# Altium schematic sheet Description_Errata.SchDoc: Description and Errata
size 279 x 215 mm; CompanyName: Flat Earth Inc.; DrawnBy: Connor Dack; Engineer: Connor Dack; Address1: 985 Technology Blvd; Address2: Suite 102; Address3: Bozeman, MT, 59718; DocumentNumber: 1; Revision: 0.0; SheetNumber: 1; SheetTotal: 8
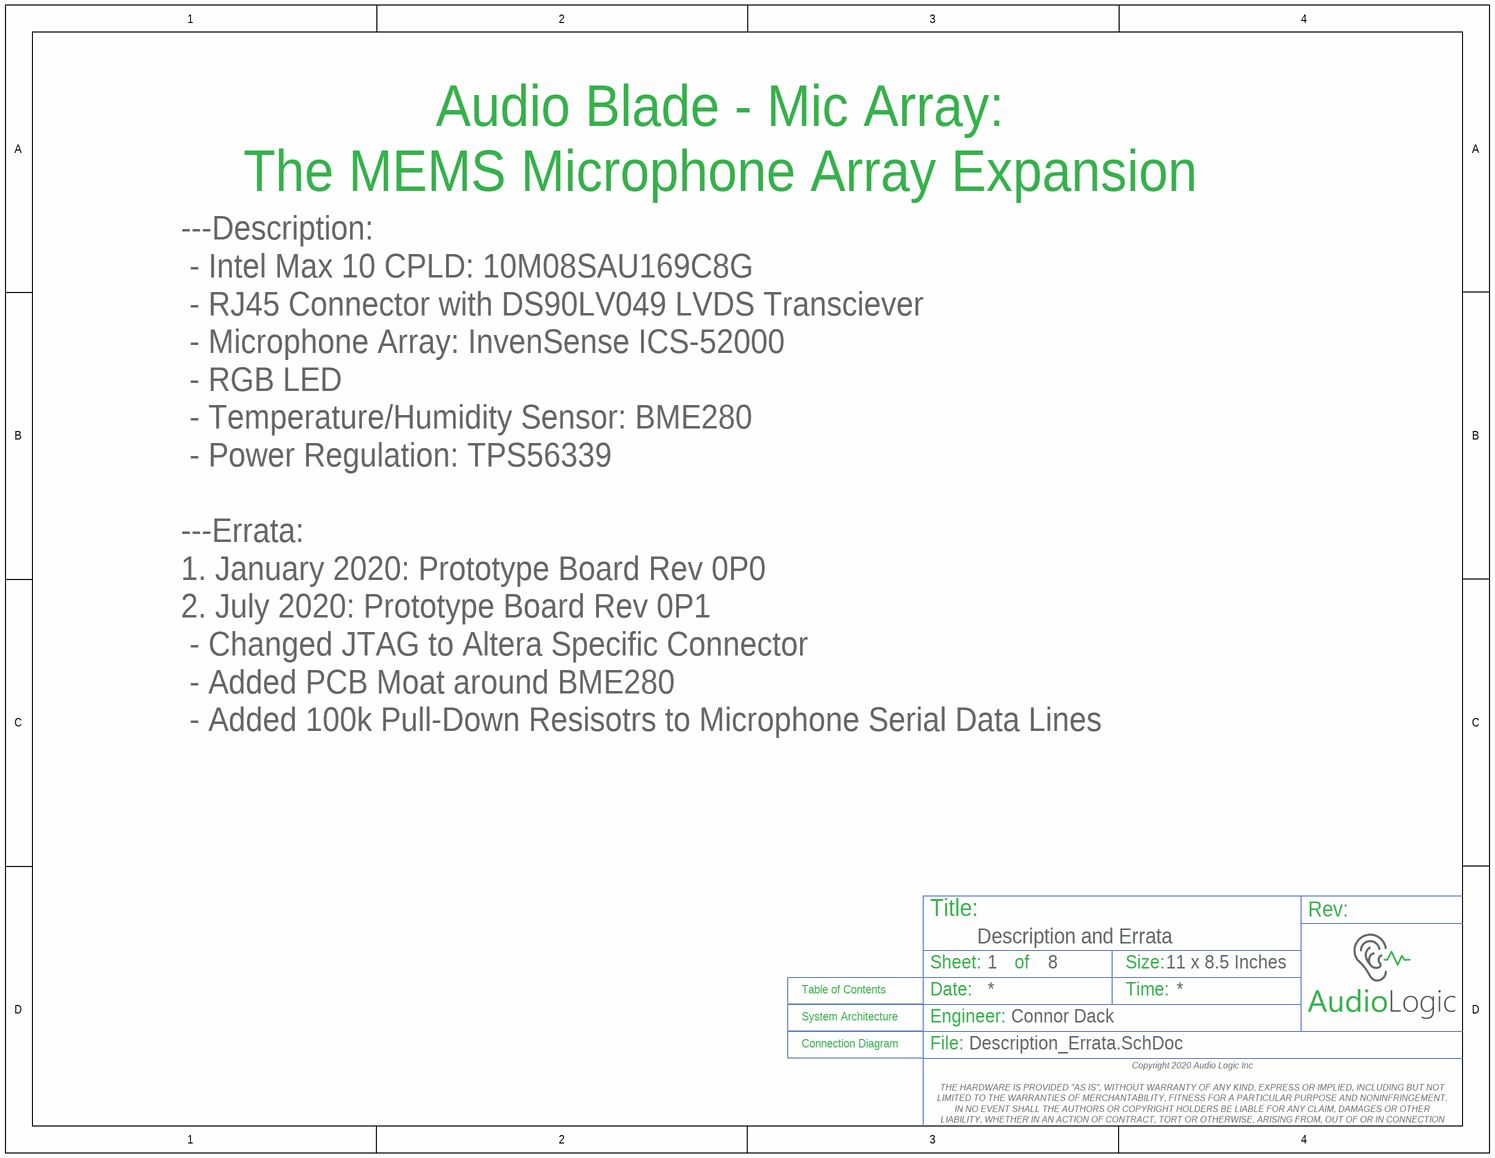
[diagram p0: Description_Errata.SchDoc]

## Sub-sheets
Connection Diagram = Top_Level_BD.SchDoc: no entries
System Architecture = System_Architecture.SchDoc: no entries
Table of Contents = Table_Of_Contents.SchDoc: no entries

## Notes on the sheet
- Audio Blade - Mic Array:
  The MEMS Microphone Array Expansion Board
- ---Description:
  - Intel Max 10 CPLD: 10M08SAU169C8G
  - RJ45 Connector with DS90LV049 LVDS Transciever
  - Microphone Array: InvenSense ICS-52000
  - RGB LED
  - Temperature/Humidity Sensor: BME280
  - Power Regulation: TPS56339
  ---Errata:
  1. January 2020: Prototype Board Rev 0P0
  2. July 2020: Prototype Board Rev 0P1
  - Changed JTAG to Altera Specific Connector
  - Added PCB Moat around BME280
  - Added 100k Pull-Down Resisotrs to Microphone Serial Data Lines
- Title:
- Sheet:
- of
- Size:
- 11 x 8.5 Inches
- Rev:
- Date:
- Engineer:
- Time:
- File:
- Copyright 2020 Audio Logic Inc
  THE HARDWARE IS PROVIDED "AS IS", WITHOUT WARRANTY OF ANY KIND, EXPRESS OR IMPLIED, INCLUDING BUT NOT LIMITED TO THE WARRANTIES OF MERCHANTABILITY, FITNESS FOR A PARTICULAR PURPOSE AND NONINFRINGEMENT. IN NO EVENT SHALL THE AUTHORS OR COPYRIGHT HOLDERS BE LIABLE FOR ANY CLAIM, DAMAGES OR OTHER LIABILITY, WHETHER IN AN ACTION OF CONTRACT, TORT OR OTHERWISE, ARISING FROM, OUT OF OR IN CONNECTION WITH THE HARDWARE OR THE USE OR OTHER DEALINGS IN THE HARDWARE.